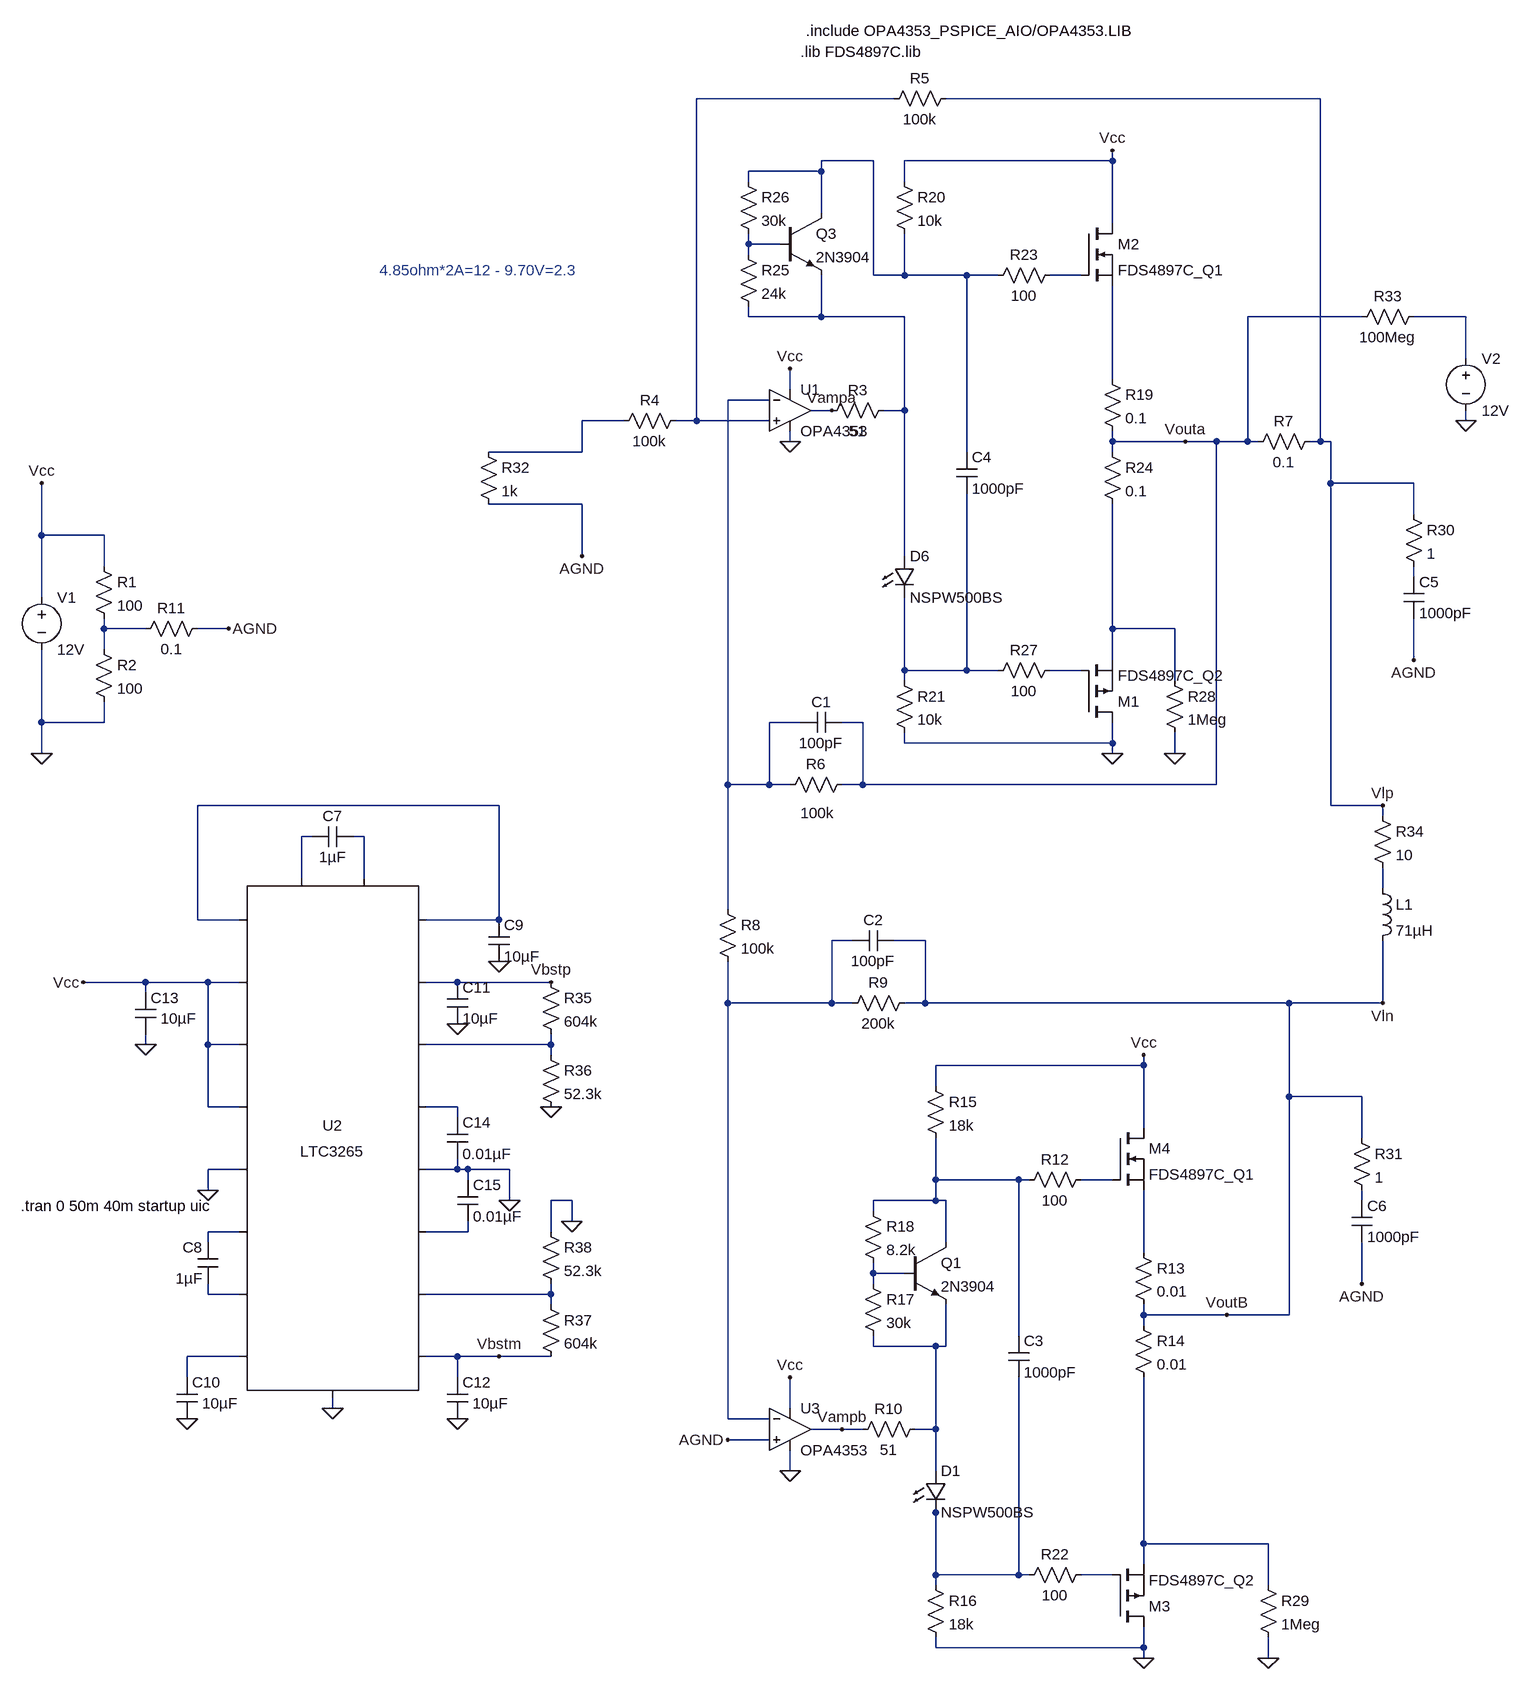
[diagram p0: schematic constcurrent_singlV_dualout_bst.asc]
constcurrent_singlV_dualout_bst.asc, the LTspice schematic file:
Version 4
SHEET 1 1956 2004
WIRE 432 -416 128 -416
WIRE 1088 -416 512 -416
WIRE 400 -320 320 -320
WIRE 768 -320 768 -336
WIRE 768 -320 448 -320
WIRE 320 -304 320 -320
WIRE 320 -304 208 -304
WIRE 208 -288 208 -304
WIRE 448 -288 448 -320
WIRE 320 -240 320 -304
WIRE 768 -224 768 -320
WIRE 208 -192 208 -208
WIRE 256 -192 208 -192
WIRE 208 -176 208 -192
WIRE 400 -144 400 -320
WIRE 448 -144 448 -208
WIRE 448 -144 400 -144
WIRE 544 -144 448 -144
WIRE 592 -144 544 -144
WIRE 720 -144 672 -144
WIRE 208 -80 208 -96
WIRE 320 -80 320 -144
WIRE 320 -80 208 -80
WIRE 448 -80 320 -80
WIRE 1152 -80 976 -80
WIRE 1312 -80 1232 -80
WIRE 1312 -16 1312 -80
WIRE 768 16 768 -128
WIRE 272 32 272 0
WIRE 240 48 176 48
WIRE 336 64 304 64
WIRE 448 64 448 -80
WIRE 448 64 416 64
WIRE 16 80 -48 80
WIRE 128 80 128 -416
WIRE 128 80 96 80
WIRE 240 80 128 80
WIRE 1312 80 1312 64
WIRE 272 112 272 96
WIRE 768 112 768 96
WIRE 880 112 768 112
WIRE 928 112 880 112
WIRE 976 112 976 -80
WIRE 976 112 928 112
WIRE 992 112 976 112
WIRE 1088 112 1088 -416
WIRE 1088 112 1072 112
WIRE 1104 112 1088 112
WIRE -48 128 -48 80
WIRE -48 128 -192 128
WIRE 544 128 544 -144
WIRE 768 128 768 112
WIRE 1104 176 1104 112
WIRE 1232 176 1104 176
WIRE -48 208 -192 208
WIRE 1232 224 1232 176
WIRE -880 256 -880 176
WIRE -784 256 -880 256
WIRE -48 288 -48 208
WIRE 448 288 448 64
WIRE -784 304 -784 256
WIRE 1232 320 1232 304
WIRE -880 352 -880 256
WIRE -784 400 -784 384
WIRE -720 400 -784 400
WIRE -592 400 -640 400
WIRE 768 400 768 208
WIRE 864 400 768 400
WIRE -784 432 -784 400
WIRE 768 448 768 400
WIRE 1232 448 1232 384
WIRE 448 464 448 352
WIRE 544 464 544 192
WIRE 544 464 448 464
WIRE 592 464 544 464
WIRE 720 464 672 464
WIRE 448 480 448 464
WIRE 864 480 864 400
WIRE -880 544 -880 432
WIRE -784 544 -784 512
WIRE -784 544 -880 544
WIRE 288 544 240 544
WIRE 384 544 352 544
WIRE 448 576 448 560
WIRE 768 576 768 544
WIRE 768 576 448 576
WIRE -880 592 -880 544
WIRE 768 592 768 576
WIRE 864 592 864 560
WIRE 176 640 176 48
WIRE 240 640 240 544
WIRE 240 640 176 640
WIRE 272 640 240 640
WIRE 384 640 384 544
WIRE 384 640 352 640
WIRE 928 640 928 112
WIRE 928 640 384 640
WIRE -176 672 -640 672
WIRE 1104 672 1104 176
WIRE 1184 672 1104 672
WIRE 1184 688 1184 672
WIRE -464 720 -480 720
WIRE -384 720 -400 720
WIRE -480 784 -480 720
WIRE -384 784 -384 720
WIRE 1184 800 1184 768
WIRE 176 832 176 640
WIRE -640 848 -640 672
WIRE -576 848 -640 848
WIRE -176 848 -176 672
WIRE -176 848 -288 848
WIRE 368 880 336 880
WIRE 480 880 432 880
WIRE -720 944 -816 944
WIRE -624 944 -720 944
WIRE -576 944 -624 944
WIRE -240 944 -288 944
WIRE -96 944 -240 944
WIRE -720 960 -720 944
WIRE 176 976 176 912
WIRE 336 976 336 880
WIRE 336 976 176 976
WIRE 368 976 336 976
WIRE 480 976 480 880
WIRE 480 976 448 976
WIRE 1040 976 480 976
WIRE 1184 976 1184 880
WIRE 1184 976 1040 976
WIRE -720 1040 -720 1024
WIRE -624 1040 -624 944
WIRE -576 1040 -624 1040
WIRE -96 1040 -96 1024
WIRE -96 1040 -288 1040
WIRE -96 1056 -96 1040
WIRE 816 1072 816 1056
WIRE 816 1072 496 1072
WIRE 496 1104 496 1072
WIRE 1040 1120 1040 976
WIRE 1152 1120 1040 1120
WIRE -624 1136 -624 1040
WIRE -576 1136 -624 1136
WIRE -240 1136 -288 1136
WIRE -240 1152 -240 1136
WIRE 816 1168 816 1072
WIRE 1152 1184 1152 1120
WIRE -576 1232 -624 1232
WIRE -240 1232 -240 1216
WIRE -240 1232 -288 1232
WIRE -224 1232 -240 1232
WIRE -160 1232 -224 1232
WIRE -224 1248 -224 1232
WIRE 496 1248 496 1184
WIRE 624 1248 496 1248
WIRE 640 1248 624 1248
WIRE 768 1248 720 1248
WIRE -624 1264 -624 1232
WIRE -160 1280 -160 1232
WIRE -64 1280 -96 1280
WIRE 496 1280 496 1248
WIRE 496 1280 400 1280
WIRE 512 1280 496 1280
WIRE 1152 1280 1152 1264
WIRE 400 1296 400 1280
WIRE -64 1312 -64 1280
WIRE -576 1328 -624 1328
WIRE -224 1328 -224 1312
WIRE -224 1328 -288 1328
WIRE -96 1328 -96 1280
WIRE -624 1344 -624 1328
WIRE 512 1344 512 1280
WIRE 816 1360 816 1264
WIRE 400 1392 400 1376
WIRE 448 1392 400 1392
WIRE 400 1408 400 1392
WIRE 1152 1408 1152 1344
WIRE -624 1424 -624 1408
WIRE -576 1424 -624 1424
WIRE -96 1424 -96 1408
WIRE -96 1424 -288 1424
WIRE -96 1440 -96 1424
WIRE 816 1456 816 1440
WIRE 944 1456 816 1456
WIRE 1040 1456 1040 1120
WIRE 1040 1456 944 1456
WIRE 816 1472 816 1456
WIRE 624 1488 624 1248
WIRE 400 1504 400 1488
WIRE 496 1504 400 1504
WIRE 512 1504 512 1440
WIRE 512 1504 496 1504
WIRE -576 1520 -656 1520
WIRE -240 1520 -288 1520
WIRE -176 1520 -240 1520
WIRE -96 1520 -176 1520
WIRE -656 1552 -656 1520
WIRE -240 1552 -240 1520
WIRE -432 1600 -432 1584
WIRE 272 1600 272 1552
WIRE 176 1616 176 976
WIRE 240 1616 176 1616
WIRE 352 1632 304 1632
WIRE 384 1632 352 1632
WIRE 496 1632 496 1504
WIRE 496 1632 464 1632
WIRE 240 1648 176 1648
WIRE 272 1696 272 1664
WIRE 496 1696 496 1632
WIRE 496 1760 496 1744
WIRE 816 1808 816 1552
WIRE 1008 1808 816 1808
WIRE 816 1840 816 1808
WIRE 496 1856 496 1760
WIRE 624 1856 624 1552
WIRE 624 1856 496 1856
WIRE 640 1856 624 1856
WIRE 768 1856 720 1856
WIRE 496 1872 496 1856
WIRE 1008 1872 1008 1808
WIRE 496 1968 496 1952
WIRE 816 1968 816 1936
WIRE 816 1968 496 1968
WIRE 816 1984 816 1968
WIRE 1008 1984 1008 1952
FLAG -880 592 0
FLAG -880 176 Vcc
FLAG 176 1648 AGND
FLAG -592 400 AGND
FLAG 272 1696 0
FLAG 272 1552 Vcc
FLAG 272 112 0
FLAG 272 0 Vcc
FLAG -48 288 AGND
FLAG 816 1056 Vcc
FLAG 816 1984 0
FLAG 768 -336 Vcc
FLAG 768 592 0
FLAG 336 64 Vampa
FLAG 352 1632 Vampb
FLAG 880 112 Vouta
FLAG 944 1456 VoutB
FLAG 1184 672 Vlp
FLAG 1184 976 Vln
FLAG 864 592 0
FLAG 1008 1984 0
FLAG 1232 448 AGND
FLAG 1152 1408 AGND
FLAG 1312 80 0
FLAG -720 1040 0
FLAG -176 912 0
FLAG -656 1616 0
FLAG -240 1616 0
FLAG -624 1264 0
FLAG -160 1280 0
FLAG -96 1136 0
FLAG -64 1312 0
FLAG -240 1008 0
FLAG -816 944 Vcc
FLAG -96 944 Vbstp
FLAG -176 1520 Vbstm
FLAG -432 1600 0
SYMBOL voltage -880 336 R0
WINDOW 123 0 0 Left 2
WINDOW 39 0 0 Left 2
SYMATTR InstName V1
SYMATTR Value 12V
SYMBOL res -800 288 R0
SYMATTR InstName R1
SYMATTR Value 100
SYMBOL res -800 416 R0
SYMATTR InstName R2
SYMATTR Value 100
SYMBOL res 432 48 R90
WINDOW 0 0 56 VBottom 2
WINDOW 3 32 56 VTop 2
SYMATTR InstName R3
SYMATTR Value 51
SYMBOL res 0 96 R270
WINDOW 0 32 56 VTop 2
WINDOW 3 0 56 VBottom 2
SYMATTR InstName R4
SYMATTR Value 100k
SYMBOL res 416 -400 R270
WINDOW 0 32 56 VTop 2
WINDOW 3 0 56 VBottom 2
SYMATTR InstName R5
SYMATTR Value 100k
SYMBOL res 256 656 R270
WINDOW 0 32 56 VTop 2
WINDOW 3 -12 58 VBottom 2
SYMATTR InstName R6
SYMATTR Value 100k
SYMBOL res 1088 96 R90
WINDOW 0 0 56 VBottom 2
WINDOW 3 32 56 VTop 2
SYMATTR InstName R7
SYMATTR Value 0.1
SYMBOL res 160 816 R0
SYMATTR InstName R8
SYMATTR Value 100k
SYMBOL res 464 960 R90
WINDOW 0 0 56 VBottom 2
WINDOW 3 32 56 VTop 2
SYMATTR InstName R9
SYMATTR Value 200k
SYMBOL res 480 1616 R90
WINDOW 0 0 56 VBottom 2
WINDOW 3 32 56 VTop 2
SYMATTR InstName R10
SYMATTR Value 51
SYMBOL res -624 384 R90
WINDOW 0 0 56 VBottom 2
WINDOW 3 32 56 VTop 2
SYMATTR InstName R11
SYMATTR Value 0.1
SYMBOL res 480 1088 R0
SYMATTR InstName R15
SYMATTR Value 18k
SYMBOL res 480 1856 R0
SYMATTR InstName R16
SYMATTR Value 18k
SYMBOL npn 448 1344 R0
SYMATTR InstName Q1
SYMATTR Value 2N3904
SYMBOL res 384 1392 R0
SYMATTR InstName R17
SYMATTR Value 30k
SYMBOL res 384 1280 R0
SYMATTR InstName R18
SYMATTR Value 8.2k
SYMBOL LED 432 288 R0
SYMATTR InstName D6
SYMATTR Value NSPW500BS
SYMATTR Description Diode
SYMATTR Type diode
SYMBOL res 432 -304 R0
SYMATTR InstName R20
SYMATTR Value 10k
SYMBOL res 432 464 R0
SYMATTR InstName R21
SYMATTR Value 10k
SYMBOL res 800 1344 R0
SYMATTR InstName R13
SYMATTR Value 0.01
SYMBOL res 800 1456 R0
SYMATTR InstName R14
SYMATTR Value 0.01
SYMBOL res 752 0 R0
SYMATTR InstName R19
SYMATTR Value 0.1
SYMBOL res 752 112 R0
SYMATTR InstName R24
SYMATTR Value 0.1
SYMBOL LED 480 1696 R0
SYMATTR InstName D1
SYMATTR Value NSPW500BS
SYMATTR Description Diode
SYMATTR Type diode
SYMBOL npn 256 -240 R0
SYMATTR InstName Q3
SYMATTR Value 2N3904
SYMBOL res 192 -192 R0
SYMATTR InstName R25
SYMATTR Value 24k
SYMBOL res 192 -304 R0
SYMATTR InstName R26
SYMATTR Value 30k
SYMBOL ind 1168 784 R0
SYMATTR InstName L1
SYMATTR Value 71µH
SYMATTR SpiceLine Rser=0
SYMBOL pmos 720 544 M180
SYMATTR InstName M1
SYMATTR Value FDS4897C_Q2
SYMATTR Prefix X
SYMBOL nmos 720 -224 R0
SYMATTR InstName M2
SYMATTR Value FDS4897C_Q1
SYMATTR Prefix X
SYMBOL pmos 768 1936 M180
SYMATTR InstName M3
SYMATTR Value FDS4897C_Q2
SYMATTR Prefix X
SYMBOL nmos 768 1168 R0
SYMATTR InstName M4
SYMATTR Value FDS4897C_Q1
SYMATTR Prefix X
SYMBOL cap 352 528 R90
WINDOW 0 0 32 VBottom 2
WINDOW 3 32 32 VTop 2
SYMATTR InstName C1
SYMATTR Value 100pF
SYMBOL cap 432 864 R90
WINDOW 0 0 32 VBottom 2
WINDOW 3 32 32 VTop 2
SYMATTR InstName C2
SYMATTR Value 100pF
SYMBOL res 736 1232 R90
WINDOW 0 0 56 VBottom 2
WINDOW 3 32 56 VTop 2
SYMATTR InstName R12
SYMATTR Value 100
SYMBOL res 736 1840 R90
WINDOW 0 0 56 VBottom 2
WINDOW 3 32 56 VTop 2
SYMATTR InstName R22
SYMATTR Value 100
SYMBOL cap 608 1488 R0
SYMATTR InstName C3
SYMATTR Value 1000pF
SYMBOL res 688 -160 R90
WINDOW 0 0 56 VBottom 2
WINDOW 3 32 56 VTop 2
SYMATTR InstName R23
SYMATTR Value 100
SYMBOL res 688 448 R90
WINDOW 0 0 56 VBottom 2
WINDOW 3 32 56 VTop 2
SYMATTR InstName R27
SYMATTR Value 100
SYMBOL cap 528 128 R0
SYMATTR InstName C4
SYMATTR Value 1000pF
SYMBOL res 848 464 R0
SYMATTR InstName R28
SYMATTR Value 1Meg
SYMBOL res 992 1856 R0
SYMATTR InstName R29
SYMATTR Value 1Meg
SYMBOL Opamps\\opamp2 272 0 R0
SYMATTR InstName U1
SYMATTR Value OPA4353
SYMBOL Opamps\\opamp2 272 1568 R0
SYMATTR InstName U3
SYMATTR Value OPA4353
SYMBOL res 1216 208 R0
SYMATTR InstName R30
SYMATTR Value 1
SYMBOL cap 1216 320 R0
SYMATTR InstName C5
SYMATTR Value 1000pF
SYMBOL res 1136 1168 R0
SYMATTR InstName R31
SYMATTR Value 1
SYMBOL cap 1136 1280 R0
SYMATTR InstName C6
SYMATTR Value 1000pF
SYMBOL res -208 112 R0
SYMATTR InstName R32
SYMATTR Value 1k
SYMBOL voltage 1312 -32 R0
WINDOW 123 0 0 Left 0
WINDOW 39 0 0 Left 0
SYMATTR InstName V2
SYMATTR Value 12V
SYMBOL res 1248 -96 R90
WINDOW 0 0 56 VBottom 2
WINDOW 3 32 56 VTop 2
SYMATTR InstName R33
SYMATTR Value 100Meg
SYMBOL res 1168 672 R0
SYMATTR InstName R34
SYMATTR Value 10
SYMBOL PowerProducts\\LTC3265 -432 1184 R0
SYMATTR InstName U2
SYMBOL cap -400 704 R90
WINDOW 0 0 32 VBottom 2
WINDOW 3 32 32 VTop 2
SYMATTR InstName C7
SYMATTR Value 1µF
SYMBOL cap -608 1408 R180
WINDOW 0 24 56 Left 2
WINDOW 3 24 8 Left 2
SYMATTR InstName C8
SYMATTR Value 1µF
SYMBOL cap -192 848 R0
SYMATTR InstName C9
SYMATTR Value 10µF
SYMBOL cap -672 1552 R0
WINDOW 3 39 40 Left 2
SYMATTR InstName C10
SYMATTR Value 10µF
SYMBOL cap -256 944 R0
SYMATTR InstName C11
SYMATTR Value 10µF
SYMBOL cap -256 1552 R0
WINDOW 3 39 40 Left 2
SYMATTR InstName C12
SYMATTR Value 10µF
SYMBOL cap -736 960 R0
WINDOW 3 39 40 Left 2
SYMATTR InstName C13
SYMATTR Value 10µF
SYMBOL cap -256 1152 R0
SYMATTR InstName C14
SYMATTR Value 0.01µF
SYMBOL cap -240 1248 R0
SYMATTR InstName C15
SYMATTR Value 0.01µF
SYMBOL res -112 928 R0
SYMATTR InstName R35
SYMATTR Value 604k
SYMBOL res -112 1040 R0
SYMATTR InstName R36
SYMATTR Value 52.3k
SYMBOL res -112 1424 R0
SYMATTR InstName R37
SYMATTR Value 604k
SYMBOL res -112 1312 R0
SYMATTR InstName R38
SYMATTR Value 52.3k
TEXT -912 1288 Left 2 !.tran 0 50m 40m startup uic
TEXT 288 -488 Left 2 !.lib FDS4897C.lib
TEXT -360 -152 Left 2 ;4.85ohm*2A=12 - 9.70V=2.3
TEXT 296 -520 Left 2 !.include OPA4353_PSPICE_AIO/OPA4353.LIB

The netlist it stands for:
* constcurrent_singlV_dualout_bst.asc
V1 Vcc 0 12V
R1 Vcc N011 100
R2 N011 0 100
R3 N005 Vampa 51
R4 N009 N001 100k
R5 N001 Vlp 100k
R6 N008 Vouta 100k
R7 Vlp Vouta 0.1
R8 N008 N019 100k
R9 Vln N019 200k
R10 N031 Vampb 51
R11 AGND N011 0.1
R15 Vcc N022 18k
R16 N033 0 18k
Q1 N022 N028 N031 0 2N3904
R17 N028 N031 30k
R18 N022 N028 8.2k
D6 N005 N013 NSPW500BS
R20 Vcc N002 10k
R21 N013 0 10k
R13 N027 Vln 0.01
R14 Vln N034 0.01
R19 N007 Vouta 0.1
R24 Vouta N012 0.1
D1 N031 N033 NSPW500BS
Q3 N002 N003 N005 0 2N3904
R25 N003 N005 24k
R26 N002 N003 30k
L1 N018 Vln 71µH Rser=0
XM1 0 N014 N012 FDS4897C_Q2  ; pins D G S
XM2 Vcc N004 N007 FDS4897C_Q1  ; pins D G S
XM3 0 N035 N034 FDS4897C_Q2  ; pins D G S
XM4 Vcc N023 N027 FDS4897C_Q1  ; pins D G S
C1 Vouta N008 100pF
C2 Vln N019 100pF
R12 N023 N022 100
R22 N035 N033 100
C3 N022 N033 1000pF
R23 N004 N002 100
R27 N014 N013 100
C4 N002 N013 1000pF
R28 N012 0 1Meg
R29 N034 0 1Meg
XU1 N001 N008 Vcc 0 Vampa OPA4353  ; pins In+ In- V+ V- OUT
XU3 AGND N019 Vcc 0 Vampb OPA4353  ; pins In+ In- V+ V- OUT
R30 Vlp N010 1
C5 N010 AGND 1000pF
R31 Vln N024 1
C6 N024 AGND 1000pF
R32 N009 AGND 1k
V2 N006 0 12V
R33 N006 Vouta 100Meg
R34 Vlp N018 10
XU2 Vcc 0 N026 N030 Vbstm N032 N029 N025 Vcc Vbstp Vcc 0 N020 N021 0 N015 N016 N015 N017 LTC3265
C7 N017 N016 1µF
C8 N029 N025 1µF
C9 N015 0 10µF
C10 N032 0 10µF
C11 Vbstp 0 10µF
C12 Vbstm 0 10µF
C13 Vcc 0 10µF
C14 N021 0 0.01µF
C15 0 N026 0.01µF
R35 Vbstp N020 604k
R36 N020 0 52.3k
R37 N030 Vbstm 604k
R38 0 N030 52.3k
.model D D
.lib standard.dio
.model NPN NPN
.model PNP PNP
.lib standard.bjt
.tran 0 50m 40m startup uic
.lib FDS4897C.lib
* 4.85ohm*2A=12 - 9.70V=2.3
.include OPA4353_PSPICE_AIO/OPA4353.LIB
.lib LTC3265.sub
.backanno
.end